# Altium schematic sheet Sheet1.SchDoc
size A4; SheetNumber: 1; SheetTotal: 1
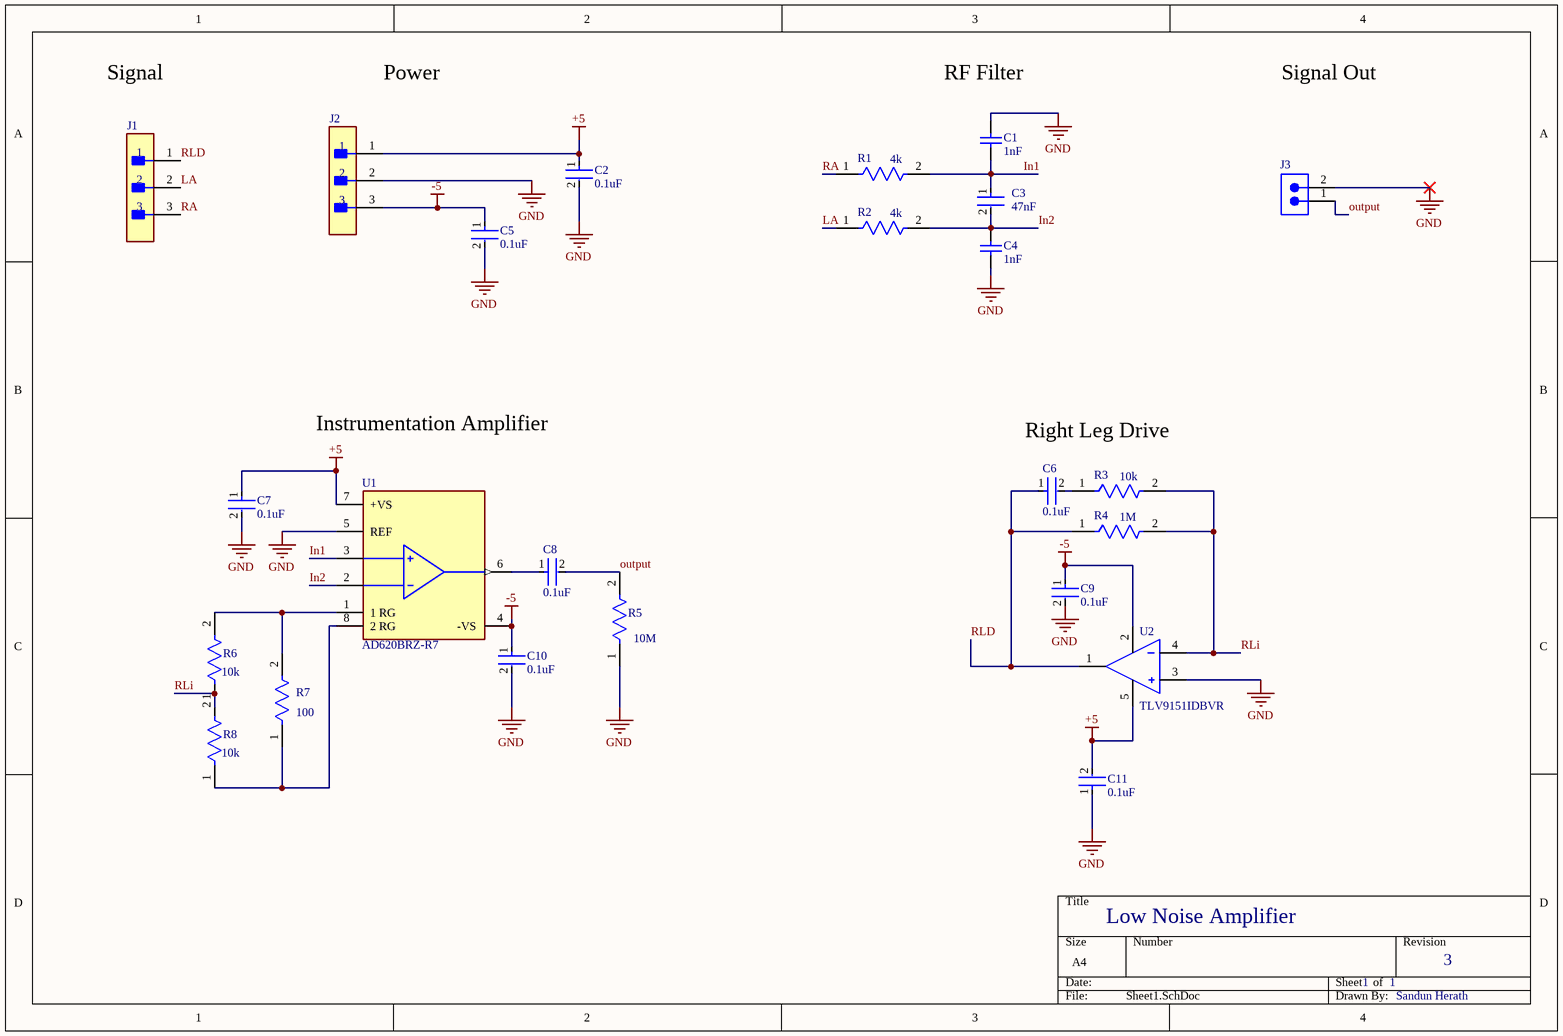
[diagram p0: Sheet1.SchDoc]

## Parts
C1  1nF  [CAPC0805(2012)145_L]
C2  0.1uF  [FP-CL21-IPC_A]
C3  47nF  [FP-GRM21B-0_1-IPC_C]
C4  1nF  [CAPC0805(2012)145_L]
C5  0.1uF  [FP-CL21-IPC_A]
C6  0.1uF  [FP-CL21-IPC_A]
C7  0.1uF  [FP-CL21-IPC_A]
C8  0.1uF  [FP-CL21-IPC_A]
C9  0.1uF  [FP-CL21-IPC_A]
C10  0.1uF  [FP-CL21-IPC_A]
C11  0.1uF  [FP-CL21-IPC_A]
J1  B3B-XH-A(LF)(SN)  [FP-B3B-XH-A_LF_SN-MFG]  (value not drawn)
J2  B3B-XH-A(LF)(SN)  [FP-B3B-XH-A_LF_SN-MFG]  (value not drawn)
J3  61300211121  [61300211121]  (value not drawn)
R1  4k  [FP-ERA6A-IPC_C]
R2  4k  [FP-ERA6A-IPC_C]
R3  10k  [FP-ERA6A-IPC_C]
R4  1M  [FP-ERA6A-IPC_C]
R5  10M  [FP-ERA6A-IPC_C]
R6  10k  [FP-ERA6A-IPC_C]
R7  100  [FP-ERA6A-IPC_C]
R8  10k  [FP-ERA6A-IPC_C]
U1  AD620BRZ-R7  [FP-R-8-IPC_C]
U2  TLV9151IDBVR  [FP-DBV0005A-IPC_A]

## Nets
+5: C2.1 C7.1 C11.2 J2.1 U1.7(+VS) U2.5(V+)
-5: C5.1 C9.1 C10.1 J2.3 U1.4(-VS) U2.2(V-)
GND: C1.2 C2.2 C4.1 C5.2 C7.2 C9.2 C10.2 C11.1 J2.2 J3.2 R5.1 U1.5(REF) U2.3(IN+)
In1: C1.1 C3.1 R1.2 U1.3(+IN)
In2: C3.2 C4.2 R2.2 U1.2(-IN)
LA: J1.2 R2.1
output: C8.2 J3.1 R5.2
RA: J1.3 R1.1
RLD: C6.1 J1.1 R4.1 U2.1(OUT)
RLi: R3.2 R4.2 R6.1 R8.2 U2.4(IN-)
NetC6_2: C6.2 R3.1
NetC8_1: C8.1 U1.6(OUTPUT)
NetR6_2: R6.2 R7.2 U1.1(1_RG)
NetR7_1: R7.1 R8.1 U1.8(2_RG)

## Notes on the sheet
- Signal
- Power
- (near C1) RF Filter
- Signal Out
- Instrumentation Amplifier
- Right Leg Drive
- Low Noise Amplifier
- 1
- 3
- Sandun Herath

## Library data of the parts
C1 C4 = CMP-1036-02976-1: CAP 1nF 50V ±5% 0805 (2012 Metric) Thickness 1.45mm SMD; Case-Metric: 2012; Tolerance: Â±5%; Case-EIA: 0805; Rated Voltage: 50 V; Technology: SMT; Max Thickness: 1.45 mm; Value: 1nF
C2 C5 C6 C8 C9 C11 = CMP-13271-004391-1: CL21 Series 0805 100nF 25V ±20% Tolerance X7R Multilayer Ceramic Chip Capacitor, CL21B104MACNNNC; Package Quantity: 1; Lead Free: Lead Free; Capacitance: 100nF; Case Code (Imperial): 0805; Depth: 1.25mm; Case/Package: 0805; Height: 0.85mm; Width: 0.049inch; Tolerance: 20%; Length: 2mm; Series: CL; Case Code (Metric): 2012; Voltage Rating (DC): 25V; Packaging: Tape and Reel; RoHS Compliant: Yes; Mount: Surface Mount; Thickness: 0.037inch; Dielectric: X7R; Min Operating Temperature: -55°C; Max Operating Temperature: 125°C; Construction: Flat; Voltage Rating: 25V; Radiation Hardening: No
C3 = CMP-06035-029151-1: Chip Multilayer Ceramic Capacitors for General Purpose, 0805, 47000pF, SL, +350/-1000ppm/°C, 5%, 50V,   GRM21B1X1H473JA01L; Packaging: Tape and Reel; Termination: SMD/SMT; Width: 0.049inch; Case Code (Metric): 2012; Thickness: 0.053inch; Tolerance: 5%; Voltage Rating: 50V; Case Code (Imperial): 0805; Max Operating Temperature: 125°C; Min Operating Temperature: -55°C; Case/Package: 0805; Mount: Surface Mount; Voltage Rating (DC): 50V; Length: 0.079inch; Capacitance: 47nF; Lead Free: Lead Free
C7 C10 = CMP-13271-004391-1: CL21 Series 0805 100nF 25V ±20% Tolerance X7R Multilayer Ceramic Chip Capacitor; Package Quantity: 1; Lead Free: Lead Free; Capacitance: 100nF; Case Code (Imperial): 0805; Depth: 1.25mm; Case/Package: 0805; Height: 0.85mm; Width: 0.049inch; Tolerance: 20%; Length: 2mm; Series: CL; Case Code (Metric): 2012; Voltage Rating (DC): 25V; Packaging: Tape and Reel; RoHS Compliant: Yes; Mount: Surface Mount; Thickness: 0.037inch; Dielectric: X7R; Min Operating Temperature: -55°C; Max Operating Temperature: 125°C; Construction: Flat; Voltage Rating: 25V; Radiation Hardening: No
J1 J2 = CMP-17439-000014-3: CONN HEADER VERT 3POS 2.5MM; Max Voltage Rating (DC): 250V; Number of Positions: 3; Current Rating: 3A; Gender: Male; Wire/Cable Gauge: 22AWG; Contact Resistance: 20mR; Insulation Resistance: 1GR; Insulation Material: Nylon; Contact Plating: Tin; Depth: 5.75mm; Contact Type: Male Pin; Max Operating Temperature: 85°C; Insulation Color: Natural; Voltage Rating (AC): 250V; Color: Natural; Connector Type: Header; Orientation: Straight; Fastening Type: Detent; Housing Color: White; Min Operating Temperature: -25°C; Termination: Solder; Voltage Rating: 250V; Series: XH; Pitch: 2.5mm; Contact Shape: Square; Number of Rows: 1; Lead Free: Lead Free; Packaging: Bulk; Mount: Through Hole; Flammability Rating: UL94 V-0; Max Voltage Rating (AC): 250V; REACH SVHC: No SVHC; Housing Material: Polyamide; Contact Material: Brass; Lead Pitch: 2.5mm; Contact Finish - Mating: TIN; Length: 9.9mm; Max Current Rating: 3A; Number of Contacts: 3
J3 = CMP-1712-00002-6: NexarPartId: 20081794; Number of Contacts: 2; Pitch: 2.54mm; Connector Type: Male Pin; Voltage Rating: 250V; Current Rating: 3A; Gender: Male; Contact Resistance: 20mΩ; Height: 8.94mm; Lead Free: Lead Free; Number of Pins: 2; Termination: Through Hole; RoHS: Compliant; Lead Pitch: 2.54mm; REACH SVHC: No SVHC; Housing Material: PBT; Contact Mating Length: 5.9944mm; Min Operating Temperature: -40°C; Orientation: Vertical; Contact Material: Copper; Contact Gender: Male; Max Operating Temperature: 125°C; Number of Rows: 1; Number of Positions: 2; Packaging: Bulk; Contact Plating: Gold; Mount: Through Hole; Color: Black; Operating Supply Voltage: 250V
R1 R2 R4 R5 R7 R8 = CMP-2001-00581-2: RES 1K OHM 0.1% 1/8W 0805,  ERA6AEB102V; Temperature Coefficient: 25ppm/°C; Resistance: 1kR; Working Voltage: 100V; Max Power Dissipation: 125mW; Height: 0.5mm; Technology: THIN FILM; REACH SVHC: No SVHC; Packaging: Tape and Reel; Length: 2mm; Width: 1.25mm; Resistance Tolerance: 0.1%; Series: ERA-6A; Resistor Type: Thin Film; Number of Pins: 2; Case Code (Metric): 2012; Voltage Rating: 100V; Radiation Hardening: No; Construction: Rectangular; Mount: Surface Mount; Number of Terminations: 2; Case/Package: 0805; Min Operating Temperature: -55°C; Military Standard: Not; RoHS Compliant: Yes; Termination: SMD/SMT; Case Code (Imperial): 0805; Depth: 1.25mm; Power Rating: 125mW; Max Operating Temperature: 155°C; Contact Plating: Tin; Package Quantity: 5000; Tolerance: 0.1%
R3 = CMP-2001-00581-2: RES 1K OHM 0.1% 1/8W 0805,   ERA6AEB102V; Temperature Coefficient: 25ppm/°C; Resistance: 1kR; Working Voltage: 100V; Max Power Dissipation: 125mW; Height: 0.5mm; Technology: THIN FILM; REACH SVHC: No SVHC; Packaging: Tape and Reel; Length: 2mm; Width: 1.25mm; Resistance Tolerance: 0.1%; Series: ERA-6A; Resistor Type: Thin Film; Number of Pins: 2; Case Code (Metric): 2012; Voltage Rating: 100V; Radiation Hardening: No; Construction: Rectangular; Mount: Surface Mount; Number of Terminations: 2; Case/Package: 0805; Min Operating Temperature: -55°C; Military Standard: Not; RoHS Compliant: Yes; Termination: SMD/SMT; Case Code (Imperial): 0805; Depth: 1.25mm; Power Rating: 125mW; Max Operating Temperature: 155°C; Contact Plating: Tin; Package Quantity: 5000; Tolerance: 0.1%
R6 = CMP-2001-00581-2: RES 1K OHM 0.1% 1/8W 0805,    ERA6AEB102V; Temperature Coefficient: 25ppm/°C; Resistance: 1kR; Working Voltage: 100V; Max Power Dissipation: 125mW; Height: 0.5mm; Technology: THIN FILM; REACH SVHC: No SVHC; Packaging: Tape and Reel; Length: 2mm; Width: 1.25mm; Resistance Tolerance: 0.1%; Series: ERA-6A; Resistor Type: Thin Film; Number of Pins: 2; Case Code (Metric): 2012; Voltage Rating: 100V; Radiation Hardening: No; Construction: Rectangular; Mount: Surface Mount; Number of Terminations: 2; Case/Package: 0805; Min Operating Temperature: -55°C; Military Standard: Not; RoHS Compliant: Yes; Termination: SMD/SMT; Case Code (Imperial): 0805; Depth: 1.25mm; Power Rating: 125mW; Max Operating Temperature: 155°C; Contact Plating: Tin; Package Quantity: 5000; Tolerance: 0.1%
U1 = CMP-09116-000394-1: IC INST AMP 1 CIRCUIT 8SOIC; Operating Supply Voltage: 18V; Max Power Dissipation: 650mW; Operating Supply Current: 1.3mA; Number of Channels: 1; Amplifier Type: INSTRUMENTATION AMPLIFIER; Input Offset Voltage (Vos): 30mV; Min Supply Voltage: 4.6V; Output Current per Channel: 18mA; Input Resistance: 10GR; Min Dual Supply Voltage: 2.3V; Common Mode Rejection Ratio: 93dB; Slew Rate: 1.2V/µs; -3db Bandwidth: 1MHz; Input Bias Current: 1nA; Number of Pins: 8; Case/Package: SOIC; Lead Free: Contains Lead; Max Operating Temperature: 125°C; Package Quantity: 1; Radiation Hardening: No; Contact Plating: Tin; Mount: Surface Mount; Min Operating Temperature: -55°C; Power Dissipation: 650mW; Nominal Supply Current: 1.3mA; Packaging: Tape and Reel; Number of Circuits: 1; RoHS Compliant: Yes; Number of Elements: 1; Max Dual Supply Voltage: 18V; Series: -
U2 = CMP-04895-000336-1: OPAMP